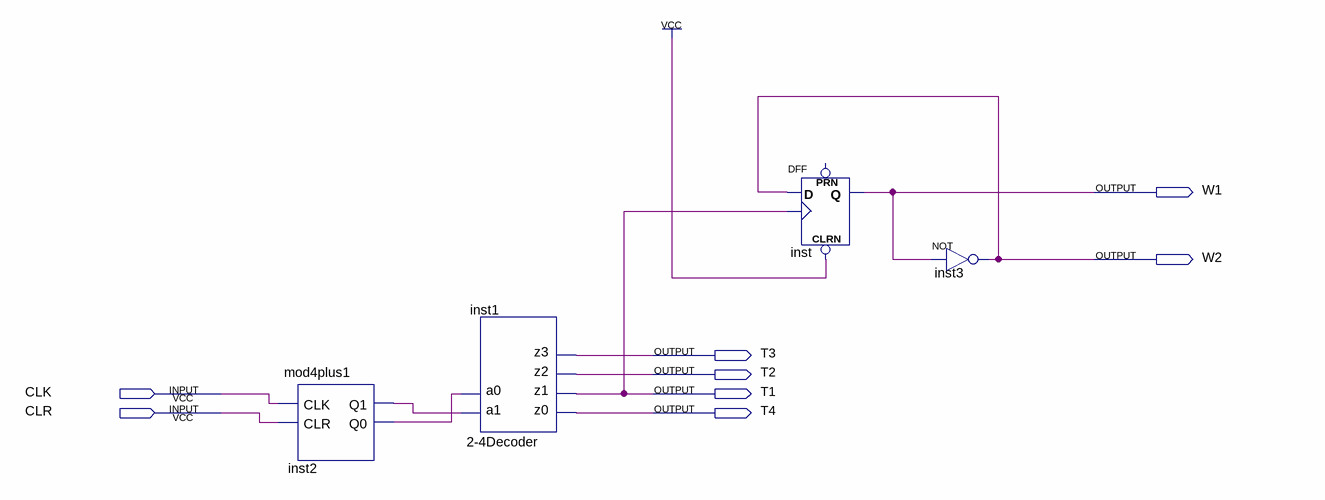
[diagram p0: schematic sheet]
// Quartus schematic jiepai.bdf as structural Verilog: 4 symbols, 8 pins
module jiepai (
  input  CLK,
  input  CLR,
  output W1,
  output W2,
  output T3,
  output T2,
  output T1,
  output T4
);

  wire inst2_q0, inst2_q1;

  mod4plus1 inst2 (.CLK(CLK), .CLR(CLR), .Q1(inst2_q1), .Q0(inst2_q0));
  \2-4Decoder  inst1 (.a1(inst2_q1), .a0(inst2_q0), .z0(T4), .z1(T1), .z2(T2), .z3(T3));
  DFF inst (.CLRN(1'b1), .CLK(T1), .D(W2), .Q(W1));  // open: PRN
  not inst3 (W2, W1);
endmodule
